# EasyEDA Pro project ProProject_【常亮24天】 低功耗-迷你桌面时钟_2024-08-04.epro, board 桌面时钟4.0-电源板-V2.8.5（德州仪器）
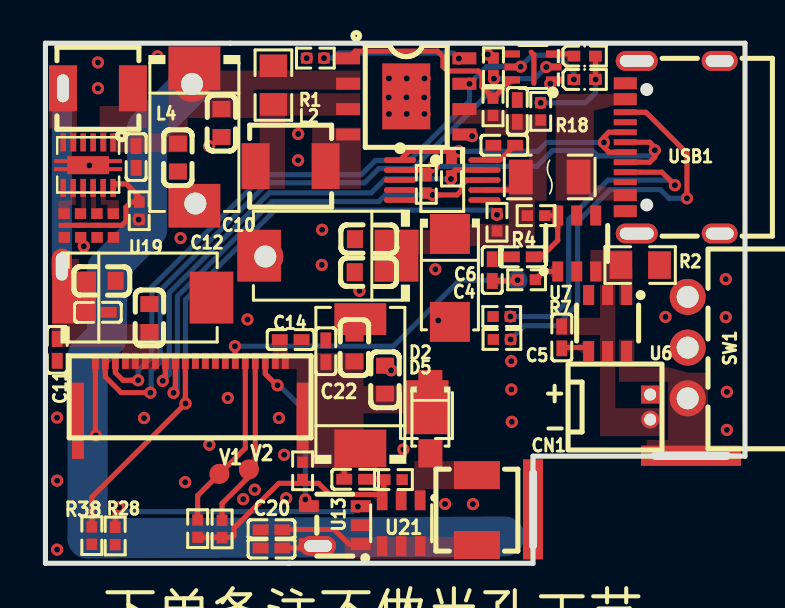
[diagram p2: board, top side]
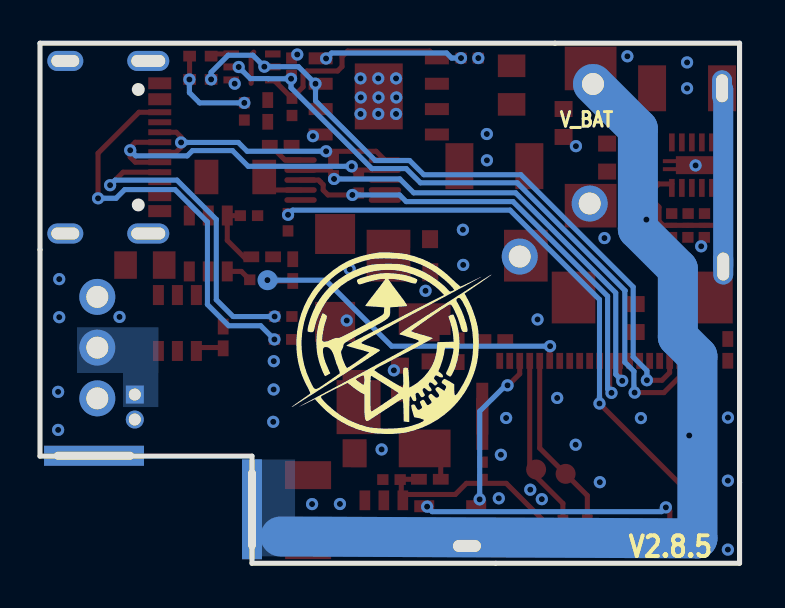
[diagram p3: board, bottom side, seen from below]

Outline 35 x 26.03 mm; copper layers: Top Layer, Bottom Layer. Coordinates in mm from the lower left corner of the outline.
Outline path: 0,26.03 35,26.03 35,5.36 24.39,5.36 24.39,0 0,0 0,26.03
Stack: Top Layer 0.035mm / Dielectric1 1.51mm FR4 er 4.5 / Bottom Layer 0.035mm

## Design rules (mm)
template: 用户自定义配置
spacing Default (default): track to track 0.152, other pairs 0 to 0.152
track width Default (default): min 0.254, default 0.254, max 25.4
differential pair differentialPair (default): width min 0.127, default 0.254, max 2.54; gap min 0.152, default 0.152
via Default (default): diameter min 0.61, default 0.61, max 100.025; hole min 0.305, default 0.305, max 59.995
net GND uses gge68793(1)

## Placement (name value [footprint] x y rotation side)
C2  100nF  [C0402]  23.6 22.64 270 top
C3  100nF  [C0402]  22.96 20.92 0 top
C4  10uF  [C0402]  22.35 14.68 90 top
C5  100nF  [C0402]  25.83 11.3 90 top
C6  10uF  [C0402]  23.88 15.34 0 top
C8  100uF  [CAP-SMD_L7.3-W4.3-FD]  14.13 15.4 180 top
C10  100uF  [CAP-SMD_L7.3-W4.3-FD]  7.45 21.34 270 top
C11  100nF  [C0402]  0.59 10.68 270 top
C12  100uF  [CAP-SMD_L7.3-W4.3-FD]  4.87 13.3 0 top
C13  100uF  [cap-smd_l7.3-w4.3-fd]  15.75 9.08 90 top
C14  10uF  [C0402]  12.27 11.2 180 top
C15  100nF  [C0402]  4.54 20.34 90 top
C19  22pF  [C0402]  15.5 4.2 180 top
C20  100nF  [C0402]  11.31 0.76 180 top
C21  100nF  [C0402]  2.63 12.56 0 top
C22  100nF  [C0402]  14.03 10.61 90 top
C23  10uF  [C0402]  11.31 1.68 180 top
C24  22uF  [C0603]  2.81 14.14 180 top
C25  22uF  [C0603]  5.2 12.28 270 top
C28  22uF  [C0603]  16.99 9.19 90 top
C29  22uF  [C0603]  15.46 10.8 90 top
C32  22uF  [C0603]  16.17 14.57 0 top
C33  22uF  [C0603]  16.19 16.23 0 top
C34  22uF  [C0603]  6.63 20.31 90 top
C35  22uF  [C0603]  8.8 22.04 90 top
CN1  M1250R-02P  [CONN-TH_2P-P1.25_L4.7-W4.3]  30.25 7.82 270 top
D2  SMAJ5.0A-C83329  [SMA_L4.3-W2.6-LS5.2-RD]  20.23 14.28 270 top
D4  DS34W  [SOD-123FL_L2.7-W1.8-LS3.8-RD]  19.26 7.24 270 top
D5  MBRM120LT1G  [DIO-SMD_L2.0-W1.9-LS3.8-RD]  19.06 6.63 270 top
L2  4.7uH  [IND-SMD_L4.1-W4.1_IHLP1616BZER4R7M11]  12.27 19.88 0 top
L4  2.2uH  [IND-SMD_L4.1-W4.1_IHLP1616BZER4R7M11]  2.63 23.78 0 top
L6  10uH  [IND-SMD_L4.1-W4.1_IHLP1616BZER4R7M11]  21.59 2.66 270 top
LED1  TZ-P2-0402YGTIA1-0.45T  [LED0402-RD_GREEN]  26.98 24.22 0 top
LED2  TZ-P2-0402 0TIA1-0.45T  [LED0402-RD_ORANGE]  26.98 25.39 0 top
NOREF  -  [Pad_e319]  1.76 16.31 0 top
NOREF#2  -  [Pad_e1179]  8.5 10.13 180 top
NOREF#3  -  [Pad_e1177]  9.5 10.13 180 top
NOREF#4  -  [Pad_e1182]  6.5 10.13 180 top
NOREF#5  -  [Pad_e1700]  32.3 5.38 270 top
NOREF#6  -  [Pad_e1175]  10.5 10.13 180 top
NOREF#7  -  [Pad_e271]  3.39 17.51 0 top
NOREF#8  -  [Pad_e1007]  7.5 18.01 270 top
NOREF#9  -  [Pad_e97]  23.62 14.17 270 top
NOREF#10  -  [Pad_e1187]  4.5 10.13 180 top
NOREF#11  -  [Pad_e1178]  8 10.13 180 top
NOREF#12  -  [Pad_e788]  12.87 7.74 180 top
NOREF#13  -  [Pad_e1183]  6 10.13 180 top
NOREF#14  -  [Pad_e272]  3.4 16.92 0 top
NOREF#15  -  [Pad_e971]  11 15.35 270 top
NOREF#16  -  [Pad_e1185]  5.5 10.13 180 top
NOREF#17  -  [Pad_e342]  0.88 23.78 0 top
NOREF#18  -  [Pad_e1184]  5 10.13 180 top
NOREF#19  -  [Pad_e320]  2.58 16.31 0 top
NOREF#20  -  [Pad_e786]  1.62 7.74 180 top
NOREF#21  -  [Pad_e266]  2.57 17.51 0 top
NOREF#22  -  [Pad_e1189]  3.5 10.13 180 top
NOREF#23  -  [Pad_e292]  0.94 16.92 0 top
NOREF#24  -  [Pad_e321]  3.4 16.31 0 top
NOREF#25  -  [Pad_e56]  13.64 0.87 270 top
NOREF#26  -  [Pad_e1171]  12 10.13 180 top
NOREF#27  -  [Pad_e1174]  10 10.13 180 top
NOREF#28  -  [Pad_e343]  0.82 14.85 0 top
NOREF#29  -  [Pad_e1186]  4 10.13 180 top
NOREF#30  -  [Pad_e297]  10.18 4.69 0 top
NOREF#31  -  [Pad_e270]  1.76 16.92 0 top
NOREF#32  -  [Pad_e269]  1.75 17.51 0 top
NOREF#33  -  [Pad_e967]  7.33 23.99 270 top
NOREF#34  -  [Pad_e1701]  24.39 2.7 180 top
NOREF#35  -  [Pad_e1181]  7 10.13 180 top
NOREF#36  -  [Pad_e1173]  11 10.13 180 top
NOREF#37  -  [Pad_e1180]  7.5 10.13 180 top
NOREF#38  -  [Pad_e1190]  2.5 10.13 180 top
NOREF#39  -  [Pad_e31]  12.87 6.98 180 top
NOREF#40  -  [Pad_e298]  8.7 4.48 0 top
NOREF#41  -  [Pad_e1172]  11.5 10.13 180 top
NOREF#42  -  [Pad_e287]  0.93 17.51 0 top
NOREF#43  -  [Pad_e1188]  3 10.13 180 top
NOREF#44  -  [Pad_e30]  1.63 6.53 180 top
NOREF#45  -  [Pad_e1176]  9 10.13 180 top
NOREF#46  -  [Pad_e318]  0.94 16.31 0 top
NOREF#47  -  [Pad_e268]  2.58 16.92 0 top
Q2  DMN3190LDW-7  [sc-70-6_l2.2-w1.3-p0.65-ls2.1-bl]  24.39 24.85 90 top
R1  200mΩ  [R0805]  11.41 23.94 270 top
R2  0.05Ω  [R0805]  29.75 14.93 180 top
R4  100K  [R0402]  22.59 17.07 270 top
R7  1K  [R0402]  24.07 14.19 0 top
R13  100K  [R0402]  4.69 17.65 90 top
R18  1.47K  [R0402]  24.78 22.62 270 top
R26  100  [R0402]  24.54 17.4 0 top
R27  20kΩ  [R0402]  13.5 25.29 180 top
R28  11kΩ  [R0402]  3.49 1.37 90 top
R30  5.1kΩ  [R0402]  22.83 12.35 180 top
R31  5.1kΩ  [R0402]  22.84 11.2 180 top
R32  22Ω  [R0402]  20.31 19.83 270 top
R33  22Ω  [R0402]  19.05 18.97 270 top
R34  620kΩ  [R0402]  8.84 1.72 270 top
R35  330kΩ  [R0402]  7.62 1.73 270 top
R36  1.1MΩ  [R0402]  12.87 4.63 90 top
R37  150kΩ  [R0402]  17.41 4.19 180 top
R38  100K  [R0402]  2.32 1.38 90 top
R39  100K  [R0402]  22.41 24.86 270 top
R40  100K  [R0402]  22.39 22.85 270 top
SW1  BSI-10H  [SW-TH_BSI-10H]  32.13 10.79 90 top
U1  CH340E  [MSOP-10_L3.0-W3.0-P0.50-LS5.0-BL]  19.85 19.18 270 top
U4  ME4059ASPG-N  [ESOP-8_L4.9-W3.9-P1.27-LS6.0-BL-EP]  18.05 23.37 270 top
U6  ME4211AM6G  [SOT-23-6_L2.9-W1.6-P0.95-LS2.8-BR]  28.12 12.03 90 top
U7  INA181A2IDBVT  [SOT-23-6_L2.9-W1.6-P0.95-LS2.8-BR]  26.58 16.01 270 top
U8  SMD1206B075TF/13.2  [F1206]  25.23 19.34 180 top
U13  MT9700  [SOT-23-5_L3.0-W1.7-P0.95-LS2.8-BR]  14.48 1.91 0 top
U19  TPS62740DSSR  [wson-12_l3.0-w2.0-p0.50-bl-ep]  2.14 19.93 180 top
U21  MT3608L  [SOT-23-6_L2.9-W1.7-P0.95-LS2.8-BL]  17.8 2 180 top
USB1  TYPE-C16PIN  [USB-C-SMD_TYPE-C16PIN]  31.37 20.83 90 top

## Footprints (pads in the part's own frame, mm; a bottom-side part is the same pattern mirrored in y, then rotated)
C0402
  rect 0.79x0.54 smd: 1(-0.545,0) 2(0.545,0)
C0603
  rect 0.8x0.9 smd: 1(-0.7,0) 2(0.7,0)
cap-smd_l7.3-w4.3-fd
  rect 1.885x2.592 smd: 1(-3.337,0)
  rect 1.585x2.592 smd: 2(3.137,0)
CAP-SMD_L7.3-W4.3-FD
  rect 2.185x2.592 smd: 1(-3.437,0) 2(3.437,0)
CONN-TH_2P-P1.25_L4.7-W4.3
  rect 0.9x0.9 hole 0.6: 1(-0.625,0)
  round 0.9 hole 0.6: 2(0.625,0)
DIO-SMD_L2.0-W1.9-LS3.8-RD
  rect 2.7x2.2 smd: 1(-1.185,-0.001)
  rect 1.27x0.77 smd: 2(1.185,0.001)
ESOP-8_L4.9-W3.9-P1.27-LS6.0-BL-EP
  rect 0.6x1.2 smd: 1(-1.905,-2.909) 2(-0.635,-2.909) 3(0.635,-2.909) 4(1.905,-2.909) 5(1.905,2.909) 6(0.635,2.909) 7(-0.635,2.909) 8(-1.905,2.909)
  rect 3.3x2.4 smd: 9(0,0)
F1206
  rect 1.19x1.728 smd: 1(-1.445,0) 2(1.445,0)
IND-SMD_L4.1-W4.1_IHLP1616BZER4R7M11
  rect 1.4x2.3 smd: 1(-1.75,0) 2(1.75,0)
LED0402-RD_GREEN
  rect 0.636x0.54 smd: 1(-0.538,0) 2(0.538,0)
LED0402-RD_ORANGE
  rect 0.636x0.54 smd: 1(-0.538,0) 2(0.538,0)
MSOP-10_L3.0-W3.0-P0.50-LS5.0-BL
  oval 0.28x1.62 smd: 1(-1,-2.11) 2(-0.5,-2.11) 3(0,-2.11) 4(0.5,-2.11) 5(1,-2.11) 6(1,2.11) 7(0.5,2.11) 8(0,2.11) 9(-0.5,2.11) 10(-1,2.11)
Pad_e30
  rect 0.6x2.6 smd: 1(0,0)
Pad_e31
  rect 0.6x2.6 smd: 1(0,0)
Pad_e56
  oval 1x1.8 hole 0.6x1.4: 3(0,0)
Pad_e97
  round 1 smd far side: 2(0,0)
Pad_e266
  rect 0.566x0.54 smd: 1(0,0)
Pad_e268
  rect 0.566x0.25 smd: 1(0,0)
Pad_e269
  rect 0.566x0.54 smd: 1(0,0)
Pad_e270
  rect 0.566x0.25 smd: 1(0,0)
Pad_e271
  rect 0.566x0.54 smd: 1(0,0)
Pad_e272
  rect 0.566x0.25 smd: 1(0,0)
Pad_e287
  rect 0.566x0.54 smd: 1(0,0)
Pad_e292
  rect 0.566x0.25 smd: 1(0,0)
Pad_e297
  round 1 smd: 2(0,0)
Pad_e298
  round 1 smd: 2(0,0)
Pad_e318
  rect 0.566x0.54 smd: 1(0,0)
Pad_e319
  rect 0.566x0.54 smd: 1(0,0)
Pad_e320
  rect 0.566x0.54 smd: 1(0,0)
Pad_e321
  rect 0.566x0.54 smd: 1(0,0)
Pad_e342
  oval 1x1.8 hole 0.6x1.4: 3(0,0)
Pad_e343
  oval 1x1.8 hole 0.6x1.4: 3(0,0)
Pad_e786
  rect 0.6x2.6 smd: 1(0,0)
Pad_e788
  rect 0.6x2.6 smd: 1(0,0)
Pad_e967
  round 1.8 hole 1.1: 3(0,0)
Pad_e971
  round 1.8 hole 1.1: 2(0,0)
Pad_e1007
  round 1.8 hole 1.1: 2(0,0)
Pad_e1171
  rect 0.34x0.8 smd: 1(0,0)
Pad_e1172
  rect 0.34x0.8 smd: 1(0,0)
Pad_e1173
  rect 0.34x0.8 smd: 1(0,0)
Pad_e1174
  rect 0.34x0.8 smd: 1(0,0)
Pad_e1175
  rect 0.34x0.8 smd: 1(0,0)
Pad_e1176
  rect 0.34x0.8 smd: 1(0,0)
Pad_e1177
  rect 0.34x0.8 smd: 1(0,0)
Pad_e1178
  rect 0.34x0.8 smd: 1(0,0)
Pad_e1179
  rect 0.34x0.8 smd: 1(0,0)
Pad_e1180
  rect 0.34x0.8 smd: 1(0,0)
Pad_e1181
  rect 0.34x0.8 smd: 1(0,0)
Pad_e1182
  rect 0.34x0.8 smd: 1(0,0)
Pad_e1183
  rect 0.34x0.8 smd: 1(0,0)
Pad_e1184
  rect 0.34x0.8 smd: 1(0,0)
Pad_e1185
  rect 0.34x0.8 smd: 1(0,0)
Pad_e1186
  rect 0.34x0.8 smd: 1(0,0)
Pad_e1187
  rect 0.34x0.8 smd: 1(0,0)
Pad_e1188
  rect 0.34x0.8 smd: 1(0,0)
Pad_e1189
  rect 0.34x0.8 smd: 1(0,0)
Pad_e1190
  rect 0.34x0.8 smd: 1(0,0)
Pad_e1700
  rect 1x5 hole 0.4x4: 1(0,0)
Pad_e1701
  rect 1x5 hole 0.4x4: 1(0,0)
R0402
  rect 0.566x0.54 smd: 1(-0.433,0) 2(0.433,0)
R0805
  rect 1.133x1.377 smd: 1(-0.966,0) 2(0.966,0)
sc-70-6_l2.2-w1.3-p0.65-ls2.1-bl
  rect 0.35x0.78 smd: 1(-0.65,-1.04) 2(0,-1.04) 3(0.65,-1.04) 4(0.65,1.04) 5(0,1.04) 6(-0.65,1.04)
SMA_L4.3-W2.6-LS5.2-RD
  rect 2x2 smd: 1(-2.2,0) 2(2.2,0)
SOD-123FL_L2.7-W1.8-LS3.8-RD
  rect 1.4x1.2 smd: 1(-1.735,0) 2(1.735,0)
SOT-23-5_L3.0-W1.7-P0.95-LS2.8-BR
  rect 1x0.6 smd: 1(1.3,-0.95) 2(1.3,0) 3(1.3,0.95) 4(-1.3,0.95) 5(-1.3,-0.95)
SOT-23-6_L2.9-W1.6-P0.95-LS2.8-BR
  rect 1x0.55 smd: 1(1.4,-0.95) 2(1.4,0) 3(1.4,0.95) 4(-1.4,0.95) 5(-1.4,0) 6(-1.4,-0.95)
SOT-23-6_L2.9-W1.7-P0.95-LS2.8-BL
  rect 0.532x0.99 smd: 1(-0.95,-1.145) 2(0,-1.145) 3(0.95,-1.145) 4(0.95,1.145) 5(0,1.145) 6(-0.95,1.145)
SW-TH_BSI-10H
  round 1.8 hole 1.1: 1(0,0) 2(2.54,0) 3(-2.54,0)
USB-C-SMD_TYPE-C16PIN
  oval 1x2.1 hole 0.6x1.7: 1(-4.32,1.788) 2(4.32,1.788)
  oval 1x1.8 hole 0.6x1.4: 3(-4.32,-2.362) 4(4.32,-2.362)
  rect 0.6x1.15 smd: A1B12(-3.2,2.362) A4B9(-2.4,2.362) B1A12(3.2,2.362) B4A9(2.4,2.362)
  rect 0.3x1.15 smd: A5(-1.25,2.362) A6(-0.25,2.362) A7(0.25,2.362) A8(-1.75,2.362) B5(1.75,2.362) B6(0.75,2.362) B7(-0.75,2.362) B8(1.25,2.362)
wson-12_l3.0-w2.0-p0.50-bl-ep
  rect 0.28x0.9 smd: 1(-1.25,-1.139) 2(-0.75,-1.139) 3(-0.25,-1.139) 4(0.25,-1.139) 5(0.75,-1.139) 6(1.25,-1.139) 7(1.25,1.139) 8(0.75,1.139) 9(0.25,1.139) 10(-0.25,1.139) 11(-0.75,1.139) 12(-1.25,1.139)
  custom 3.4x0.9 smd: 13(0,0)

## Nets
5V: C13.1 C14.2 C19.2 C22.1 C28.1 C29.1 D4.1 D5.1 NOREF#12.1 NOREF#26.1 NOREF#39.1 NOREF#41.1 R36.2
5VEN: NOREF#36.1 U13.4
GND: C2.1 C3.1 C4.2 C6.1 C8.2 C10.2 C11.2 C12.2 C13.2 C14.1 C15.1 C20.2 C21.2 C22.2 C23.2 C24.1 C25.1 C28.2 C29.2 C32.1 C33.1 C34.1 C35.1 D2.2 NOREF.1 NOREF#2.1 NOREF#8.2 NOREF#11.1 NOREF#15.2 NOREF#19.1 NOREF#24.1 NOREF#37.1 NOREF#45.1 NOREF#46.1 Q2.1 Q2.4 R2.1 R27.2 R28.1 R30.2 R31.2 R37.1 R38.1 R39.1 U1.3 U4.5 U4.9 U6.3 U7.2 U7.4 U7.5 U13.2 U19.3 U19.4 U19.13 U21.2 USB1.1 USB1.2 USB1.3 USB1.4 USB1.A1B12 USB1.B1A12
VIN: C2.2 C8.1 C32.2 C33.2 D2.1 R4.2 R18.2 R26.1 R40.2 U1.7 U4.6 U8.2
VIN1: U8.1 USB1.A4B9 USB1.B4A9
3.3: C11.1 C12.1 C21.1 C24.2 C25.2 L4.1 NOREF#10.1 NOREF#16.1 NOREF#17.3 NOREF#18.1 NOREF#28.3 NOREF#29.1 U19.5
ADC6: C4.1 NOREF#3.1 NOREF#9.2 R7.1
BVIN1+: CN1.1 SW1.1
BVIN+: C10.1 C15.2 C20.1 C34.2 C35.2 NOREF#25.3 NOREF#33.3 NOREF#34.1 NOREF#38.1 R1.1 R13.1 U4.2 U13.5 U19.1
BVIN-: C5.2 CN1.2 U6.2 U6.5
BVIN_B+: NOREF#5.1 SW1.3 U6.6
D+: R32.1 U1.1 USB1.A6 USB1.B6
D-: R33.1 U1.2 USB1.A7 USB1.B7
EN: NOREF#43.1 Q2.2 R39.2
EN_2: Q2.6 R40.1 U4.1
FB1: C19.1 R34.2 R35.2 R36.1 R37.2 U21.3
GHRG: LED1.1 NOREF#22.1 Q2.5 U4.7
OLEDV1: NOREF#6.1 NOREF#30.2 R34.1
OLEDV2: NOREF#27.1 NOREF#40.2 R35.1
RX: NOREF#13.1 R32.2 U1.9
TX: NOREF#4.1 R33.2 U1.8
VIN/2: NOREF#35.1 R4.1 R38.2
VS1: NOREF#7.1 U19.11
VS2: NOREF#21.1 U19.10
VS3: NOREF#32.1 U19.9
VS4: NOREF#42.1 U19.8
$1N57: R30.1 USB1.A5
$1N121: LED1.2 LED2.2 R18.1
$1N151: R27.1 U4.8
$1N154: L2.2 U4.4
$1N155: L2.1 R1.2 U4.3
$1N234: C3.2 U1.10
$1N676: R2.2 U6.1 U7.3
$1N681: C6.2 R26.2 U7.6
$1N911: C5.1 U6.4
$1N920: R7.2 U7.1
$1N2308: LED2.1 Q2.3
$1N12281: R28.2 U13.3
$1N17078: L4.2 U19.2
$1N17143: NOREF#14.1 NOREF#23.1 NOREF#31.1 NOREF#47.1 R13.2 U19.12
$1N22881: C23.1 L6.2 U13.1 U21.4 U21.5 U21.6
$1N30925: R31.1 USB1.B5
$1N37752: D4.2 D5.2 L6.1 U21.1

Pads without a net: NOREF#20 1; NOREF#44 1; SW1 2; U1 4 5 6; U19 6 7; USB1 A8 B8

## Via types
v1: diameter 0.61, hole 0.305, Top Layer to Bottom Layer, 85 vias

## Routing (per net, layer and track width the routed paths; a pad name or vN(x,y) marks a point on that pad's centre or on a via; arc(x,y) is an arc through that point)
5V: length 1.9
  Top Layer w0.254: C13.1 14.95,4.94 C19.2
5VEN: length 8.3
  Top Layer w0.254: NOREF#36.1 11,9.48 11.57,8.91 v1(11.61,8.91) ; v1(13,3.2) 13.18,3.02 U13.4
  Bottom Layer w0.254: v1(13,3.2) 13,7.6 11.7,8.91 v1(11.61,8.91)
GND: length 1.6
  Top Layer w0.254: 24.3,25.59 24.44,25.46 24.44,24.03
  vias: v1(0.58,7.29) v1(0.59,4.14) v1(0.59,0.68) v1(1.92,15.87) v1(2.2,19.92) v1(2.63,25.07) v1(2.63,23.78) v1(4.94,7.27) v1(5.61,25.38) v1(6.76,16.28) v1(6.99,4.06) v1(8.19,20.88) v1(8.2,5.93) v1(9.12,8.28) v1(9.89,3.21) v1(10.11,12.2) v1(10.47,3.68) v1(11.68,7.27) v1(11.94,5.43) v1(12.05,3.25) v1(12.65,21.49) v1(12.64,20.17) v1(13.07,25.29) v1(13.84,16.7) v1(13.83,14.94) v1(15.71,13.64) v1(17.19,24.27) v1(17.17,23.32) v1(17.19,22.49) v1(17.29,9.66) v1(17.91,5.7) v1(18.06,23.32) v1(18.07,24.27) v1(18.07,22.49) v1(18.96,24.27) v1(18.95,23.32) v1(18.96,22.49) v1(19.51,14.72) v1(19.65,12.15) v1(19.99,2.97) v1(21.34,21.38) v1(21.39,2.96) v1(22.13,25.47) v1(23.3,10.12) v1(23.31,8.7) v1(23.33,7.08) v1(25.26,24.01) v1(31.02,12.33) v1(34.04,14.22) v1(34.04,12.32) v1(34.09,8.58) v1(34.09,6.68)
VIN: length 1.7
  Top Layer w0.254: 23.69,18.73 23.64,18.68 U1.7
3.3: length 8.9
  Bottom Layer w1: L4.1 0.82,23.72 NOREF#28.3
ADC6: length 17.6
  Top Layer w0.254: NOREF#3.1 9.5,10.85 v1(9.48,10.87) ; 23.62,14.17 R7.1 ; v1(23.62,14.17) 23.58,14.13 C4.1
  Bottom Layer w0.254: NOREF#9.2 20.71,14.17 17.41,10.87 v1(9.48,10.87)
BVIN+: length 50.9
  Top Layer w0.254: 13.18,0.96 12.98,0.76 C20.1 ; NOREF#38.1 2.5,6.42 v1(2.52,6.4)
  Bottom Layer w2: NOREF#33.3 5.09,21.75 5.09,16.73 3.09,14.73 3.09,11.33 2.11,10.36 2.11,1.24 22.97,1.34
  vias: v1(4.66,17.2)
D+: length 13.9
  Top Layer w0.254: 29.01,21.58 28.18,21.58 27.94,21.34 v1(27.94,21.07) 27.94,20.83 28.19,20.58 29.01,20.58 ; U1.1 18.18,20.62 v1(20.68,20.62) 20.32,20.27 20.31,20.27
  Bottom Layer w0.254: v1(20.68,20.62) 24.63,20.62 25.08,21.07 v1(27.94,21.07)
D-: length 17.6
  Top Layer w0.254: R33.1 19.4,19.75 v1(19.4,19.87) 19.22,19.68 U1.2 ; 29.01,21.08 30.23,21.08 30.49,20.82 v1(30.49,20.68) 30.49,20.33 30.23,20.08 USB1.B7
  Bottom Layer w0.254: v1(30.49,20.68) 30.2,20.39 27.63,20.39 27.37,20.66 25.37,20.66 24.58,19.87 v1(19.4,19.87)
EN: length 32.9
  Top Layer w0.254: NOREF#43.1 3,9.33 3.79,8.54 v1(5.25,8.54)
  Bottom Layer w0.254: v1(25.06,24.84) 24.48,24.26 23.6,24.26 23.59,24.26 v1(22.44,24.26) 22.44,23.8 18.39,19.76 16.68,19.76 15.97,19.05 11.13,19.05 5.73,13.65 5.74,13.64 5.74,10.07 5.29,9.61 5.29,8.58 v1(5.25,8.54)
EN_2: length 10.6
  Top Layer w0.254: 23.55,24.2 23.31,24.2 R40.1 22.39,23.29 21.84,23.85 21.84,24.45 21.65,24.64 20.11,24.64 19.89,24.86 19.89,25.36 19.61,25.64 15.5,25.64 U4.1
FB1: length 13
  Top Layer w0.254: 7.62,1.29 9.34,1.29 9.43,1.38 9.43,1.76 11.67,4 13.67,4 14.22,3.44 16.79,3.44 16.83,3.41 16.83,3.19 16.92,3.29 16.92,4.21 16.92,4.2 C19.1
GHRG: length 34
  Top Layer w0.254: v1(4.64,9.16) 3.88,9.16 3.5,9.54 NOREF#22.1
  Bottom Layer w0.254: v1(4.64,9.16) 4.64,9.64 5.32,10.33 5.32,13.83 10.94,19.45 15.8,19.45 16.51,20.16 18.23,20.16 21.22,23.15 v1(21.22,24.01) 22.07,24.86 v1(23.78,24.86) 24.35,25.43 25.58,25.43 26.44,24.58 v1(26.44,24.22)
OLEDV1: length 8.7
  Top Layer w0.254: 8.84,2.14 8.84,2.99 10.5,4.65 NOREF#6.1
OLEDV2: length 9
  Top Layer w0.254: NOREF#27.1 10,5.76 8.71,4.48 NOREF#40.2 7.62,3.39 7.62,2.16
RX: length 24.2
  Top Layer w0.254: NOREF#13.1 6,9.26 v1(5.87,9.13) ; U1.9 20.49,19.68 20.29,19.48 v1(20.29,19.24) 20.31,19.26 R32.2
  Bottom Layer w0.254: v1(5.87,9.13) 6.2,9.46 6.2,13.54 11.2,18.54 16.3,18.54 17,19.24 v1(20.29,19.24)
TX: length 24.9
  Top Layer w0.254: R33.2 19.28,18.53 v1(19.37,18.44) 20.59,18.44 20.83,18.68 20.83,18.95 20.96,19.08 ; NOREF#4.1 6.5,8.62 v1(6.41,8.53) ; 20.96,19.08 20.96,19.09 ; 20.96,19.08 21.06,19.18 U1.8
  Bottom Layer w0.254: v1(6.41,8.53) 6.6,8.72 6.6,13.37 11.34,18.11 16.68,18.11 17.01,18.44 v1(19.37,18.44)
VIN/2: length 33
  Top Layer w0.254: NOREF#35.1 7,8.01 v1(7.01,8) 2.32,3.31 R38.2
  Bottom Layer w0.254: 22.59,17.44 22.36,17.68 11.48,17.68 7.01,13.2 v1(7.01,8)
  vias: v1(22.59,17.44)
$1N57: length 16.3
  Top Layer w0.254: USB1.A5 30.84,19.58 31.49,18.92
  Bottom Layer w0.254: v1(31.49,18.93) 31.24,19.18 28.14,19.18 26.18,17.21 26.18,13.19 25.34,12.35 v1(23.26,12.35)
$1N121: length 4.8
  Top Layer w0.254: 27.51,24.22 LED2.2
  Bottom Layer w0.254: v1(27.52,24.22) 27.52,23.56 27.01,23.05 v1(24.78,23.05)
$1N151: length 7
  Bottom Layer w0.254: v1(20.69,25.27) 20.41,25.54 14.66,25.54 14.4,25.29 v1(13.94,25.29)
$1N234: length 1.8
  Top Layer w0.254: U1.10 22.74,20.18 23.48,20.92 C3.2
$1N681: length 3.6
  Top Layer w0.254: R26.2 25.62,17.4 U7.6 25.63,16.16 24.71,15.24 24.35,15.24
$1N911: length 1.5
  Top Layer w0.254: 27.21,10.57 26.98,10.8 25.88,10.8 C5.1
$1N920: length 1.3
  Top Layer w0.254: U7.1 24.92,14.61 R7.2
$1N2308: length 1.3
  Top Layer w0.254: 25.23,25.5 26.33,25.5 LED2.1
$1N12281: length 13.2
  Top Layer w0.254: R28.2 3.49,2.6 v1(3.69,2.8)
  Bottom Layer w0.254: v1(3.69,2.8) 3.9,2.58 15.38,2.58 v1(15.63,2.83)
$1N17143: length 6.5
  Top Layer w0.254: 3.39,18.99 4.05,18.99 4.69,18.34 4.69,18.08 4.28,18.08 4.03,17.83 4.03,17.12 3.82,16.92 NOREF#14.1 NOREF#47.1 NOREF#31.1 NOREF#23.1
$1N22881: length 4.2
  Top Layer w0.254: 15.78,0.96 15.18,0.96 14.45,1.69 11.87,1.69 C23.1
$1N30925: length 20.7
  Top Layer w0.254: USB1.B5 30.04,22.58 32.09,20.53 v1(32.09,18.27)
  Bottom Layer w0.254: v1(23.27,11.2) 23.96,11.89 25.56,11.89 26.62,12.96 26.62,17.08 28.25,18.71 30.76,18.71 31.19,18.27 v1(32.09,18.27)

## Copper pours and planes (outline as drawn; the poured copper is in the pictures)
5V on Top Layer: 12.57,10.52 15.91,10.52 15.91,4.78 12.57,4.78
5V on Top Layer: 15.51,8.88 18.86,8.88 18.86,7.5 15.51,7.5
5V on Top Layer: 11.39,11.47 12.12,11.47 12.12,9.75 11.39,9.75
5V on Top Layer: 11.33,10.52 15.85,10.52 15.85,9.73 11.33,9.73
GND on Top Layer: 0,26.03 35.05,26.03 35.05,-0.01 0,-0.01
GND on Bottom Layer: 0,26.03 35.05,26.03 35.05,-0.01 0,-0.01
VIN on Top Layer: 21.99,22.48 25.07,22.48 25.07,21.44 21.99,21.44
VIN on Top Layer: 20.64,16.99 24.01,16.99 24.01,15.87 20.64,15.87
VIN on Top Layer: 20.36,22.72 23.12,22.72 23.12,22 20.36,22
VIN on Top Layer: 23.19,20.2 24.48,20.2 24.48,15.87 23.19,15.87
VIN on Top Layer: 24.21,22.42 25.07,22.42 25.07,18.15 24.21,18.15
VIN on Top Layer: 16.55,16.69 20.81,16.69 20.81,15.49 16.55,15.49
VIN1 on Top Layer: 26.29,23.49 28.7,23.49 28.7,22.35 26.29,22.35
VIN1 on Top Layer: 26.29,19.24 28.83,19.24 28.83,18.16 26.29,18.16
VIN1 on Top Layer: 25.53,23.49 27.43,23.49 27.43,18.16 25.53,18.16
3.3 on Top Layer: 0.18,24.72 1.57,24.72 1.57,21.76 0.18,21.76
3.3 on Top Layer: 0.33,15.23 1.69,15.23 1.69,11.41 0.33,11.41
3.3 on Top Layer: 0.34,13.41 2.53,13.41 2.53,11.08 0.34,11.08
3.3 on Top Layer: 0.32,11.98 5.67,11.98 5.67,10.82 0.32,10.82
3.3 on Top Layer: 3.84,11.02 5.67,11.02 5.67,9.7 3.84,9.7
BVIN1+ on Bottom Layer: 29.08,11.81 33.15,11.81 33.15,9.53 29.08,9.53
BVIN1+ on Bottom Layer: 29.08,11.81 30.85,11.81 30.85,7.82 29.08,7.82
BVIN+ on Top Layer: 6.16,23.27 7.12,23.27 7.12,20.58 6.16,20.58
BVIN+ on Top Layer: 6.18,24.66 15.76,24.66 15.76,23.72 6.18,23.72
BVIN+ on Top Layer: 3.22,21.52 7.11,21.52 7.11,20.58 3.22,20.58
BVIN+ on Top Layer: 6.16,24.36 10.42,24.36 10.42,22.29 6.16,22.29
BVIN+ on Bottom Layer: 22.24,5.19 24.41,5.19 24.41,0.35 22.24,0.35
BVIN- on Top Layer: 27.74,7.77 30.96,7.77 30.96,6.36 27.74,6.36
BVIN- on Top Layer: 25.54,12.28 28.51,12.28 28.51,11.43 25.54,11.43
BVIN- on Top Layer: 27.74,13.93 28.51,13.93 28.51,6.5 27.74,6.5
BVIN_B+ on Top Layer: 30.08,6.17 33.07,6.17 33.07,5.66 30.08,5.66
BVIN_B+ on Top Layer: 31.16,9.54 33.15,9.54 33.15,5.63 31.16,5.63
BVIN_B+ on Top Layer: 28.7,9.8 31.22,9.8 31.22,9.09 28.7,9.09
BVIN_B+ on Top Layer: 28.7,11.2 29.46,11.2 29.46,9.1 28.7,9.1
$1N154 on Top Layer: 13.34,21.8 15.78,21.8 15.78,18.75 13.34,18.75
$1N155 on Top Layer: 10.73,23.52 15.74,23.52 15.74,22.42 10.73,22.42
$1N155 on Top Layer: 10.72,23.54 11.99,23.54 11.99,18.74 10.72,18.74
$1N676 on Top Layer: 28.71,14.8 29.37,14.8 29.37,12.92 28.71,12.92
$1N676 on Top Layer: 27.26,15.68 29.36,15.68 29.36,14.11 27.26,14.11
$1N17078 on Top Layer: 2.72,22.89 5.08,22.89 5.08,21.78 2.72,21.78
$1N22881 on Top Layer: 14.97,1.32 22.74,1.32 22.74,0.21 14.97,0.21
$1N37752 on Top Layer: 18.45,5.11 22.74,5.11 22.74,3.71 18.45,3.71

Small or netless copper shapes (teardrops, artwork), in the pictures only: 104 on Top Layer, 37 on Bottom Layer

## Text on the board
Bottom Silkscreen Layer: V_BAT | V2.8.5
Top Silkscreen Layer: V1 | V2 | + | - | 下单备注不做半孔工艺
